# Altium project USB Hub Breakout V2.PrjPcb
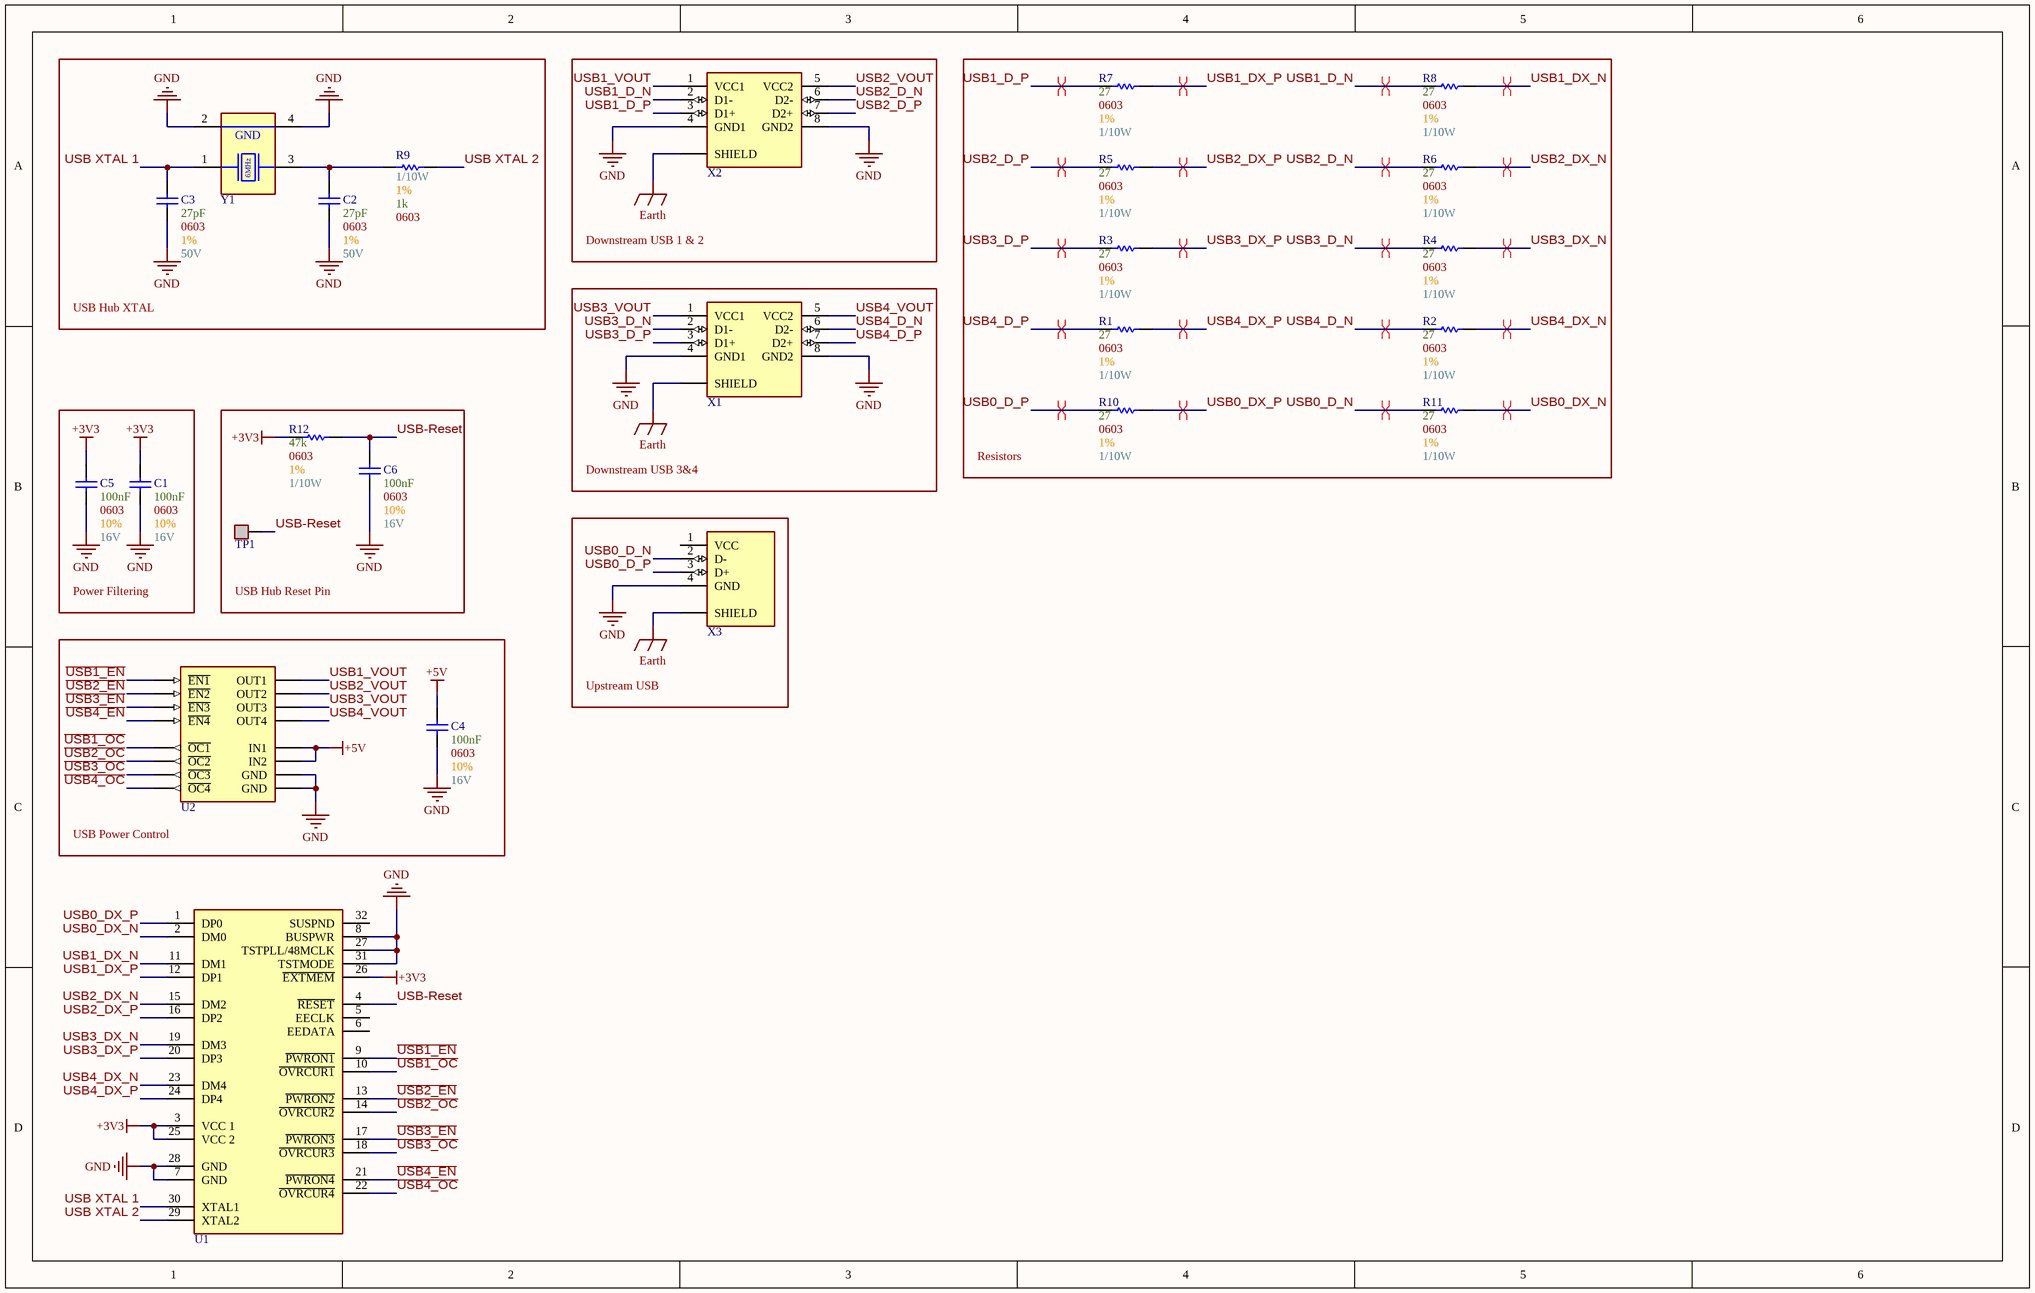
[diagram p0: USB Hub.SchDoc]
2 sheets, 38 parts. Net scope: global (net labels, ports and power ports of the same name join across sheets).
Board file: Main.PcbDoc
Sheets:
  USB Hub.SchDoc
  Regulator.SchDoc

## Sheet USB Hub.SchDoc
size B; SheetNumber: 1; SheetTotal: 2

### Parts
C1  Max Voltage: 16V  Size Package: 0603  Tolerance: 10%  Capacitance: 100nF  [[Cap] SMD 0603]  (hidden comment: [Cap] 0603 0.1uF 10% 16V)
C2  Max Voltage: 50V  Size Package: 0603  Tolerance: 1%  Capacitance: 27pF  [[Cap] SMD 0603]  (hidden comment: [Cap] 0603 27pF 1% 50V)
C3  Max Voltage: 50V  Size Package: 0603  Tolerance: 1%  Capacitance: 27pF  [[Cap] SMD 0603]  (hidden comment: [Cap] 0603 27pF 1% 50V)
C4  Max Voltage: 16V  Size Package: 0603  Tolerance: 10%  Capacitance: 100nF  [[Cap] SMD 0603]  (hidden comment: [Cap] 0603 0.1uF 10% 16V)
C5  Max Voltage: 16V  Size Package: 0603  Tolerance: 10%  Capacitance: 100nF  [[Cap] SMD 0603]  (hidden comment: [Cap] 0603 0.1uF 10% 16V)
C6  Max Voltage: 16V  Size Package: 0603  Tolerance: 10%  Capacitance: 100nF  [[Cap] SMD 0603]  (hidden comment: [Cap] 0603 0.1uF 10% 16V)
R1  Wattage: 1/10W  Tolerance: 1%  Resistance: 27  Size Package: 0603  [[Res] SMD 0603]  (hidden comment: [27] SMD 0603 1% 1/10W)
R2  Wattage: 1/10W  Tolerance: 1%  Resistance: 27  Size Package: 0603  [[Res] SMD 0603]  (hidden comment: [27] SMD 0603 1% 1/10W)
R3  Wattage: 1/10W  Tolerance: 1%  Resistance: 27  Size Package: 0603  [[Res] SMD 0603]  (hidden comment: [27] SMD 0603 1% 1/10W)
R4  Wattage: 1/10W  Tolerance: 1%  Resistance: 27  Size Package: 0603  [[Res] SMD 0603]  (hidden comment: [27] SMD 0603 1% 1/10W)
R5  Wattage: 1/10W  Tolerance: 1%  Resistance: 27  Size Package: 0603  [[Res] SMD 0603]  (hidden comment: [27] SMD 0603 1% 1/10W)
R6  Wattage: 1/10W  Tolerance: 1%  Resistance: 27  Size Package: 0603  [[Res] SMD 0603]  (hidden comment: [27] SMD 0603 1% 1/10W)
R7  Wattage: 1/10W  Tolerance: 1%  Resistance: 27  Size Package: 0603  [[Res] SMD 0603]  (hidden comment: [27] SMD 0603 1% 1/10W)
R8  Wattage: 1/10W  Tolerance: 1%  Resistance: 27  Size Package: 0603  [[Res] SMD 0603]  (hidden comment: [27] SMD 0603 1% 1/10W)
R9  Wattage: 1/10W  Tolerance: 1%  Resistance: 1k  Size Package: 0603  [[Res] SMD 0603]  (hidden comment: [1k] SMD 0603 1% 1/10W)
R10  Wattage: 1/10W  Tolerance: 1%  Resistance: 27  Size Package: 0603  [[Res] SMD 0603]  (hidden comment: [27] SMD 0603 1% 1/10W)
R11  Wattage: 1/10W  Tolerance: 1%  Resistance: 27  Size Package: 0603  [[Res] SMD 0603]  (hidden comment: [27] SMD 0603 1% 1/10W)
R12  Wattage: 1/10W  Tolerance: 1%  Resistance: 47k  Size Package: 0603  [[Res] SMD 0603]  (hidden comment: [47k] SMD 0603 1% 1/10W)
TP1  [THM] Thru-Hole  [[THM] White]  (value not drawn)
U1  4port  [[USB Hub] USB2.0 4port]  (value not drawn)
U2  [USB Power] 500mA 4port  [[IC] USB Hub Power Distribution]  (value not drawn)
X1  USB-A  [[USB] Type-A Dual]  (value not drawn)
X2  USB-A  [[USB] Type-A Dual]  (value not drawn)
X3  USB-A  [[USB] Type-A]  (value not drawn)
Y1  [Crystal] SMD 6MHz  [[Crystal] SMD 6MHz]  (value not drawn)

### Blocks framed on the sheet
USB Hub XTAL: C2 C3 R9 Y1
Downstream USB 1 & 2: X2
Resistors: R1-R8 R10 R11
Downstream USB 3&4: X1
Power Filtering: C1 C5
USB Hub Reset Pin: C6 R12 TP1
Upstream USB: X3
USB Power Control: C4 U2

### Nets
+3V3: C1.2 C5.2 R12.1 U1.3(VCC_1) U1.25(VCC_2) U1.26(~{EXTMEM})
+5V: C4.2 U2.2(IN1) U2.6(IN2)
Earth: X1.MH(SHIELD) X2.MH(SHIELD) X3.MH(SHIELD)
GND: C1.1 C2.1 C3.1 C4.1 C5.1 C6.1 U1.7(GND) U1.8(BUSPWR) U1.27(TSTPLL/48MCLK) U1.28(GND) U1.31(TSTMODE) U2.1(GND) U2.5(GND) X1.4(GND1) X1.8(GND2) X2.4(GND1) X2.8(GND2) X3.4(GND) Y1.2(GND) Y1.4(GND)
~{USB1_EN}: U1.9(~{PWRON1}) U2.3(~{EN1})
~{USB1_OC}: U1.10(~{OVRCUR1}) U2.16(~{OC1})
~{USB2_EN}: U1.13(~{PWRON2}) U2.4(~{EN2})
~{USB2_OC}: U1.14(~{OVRCUR2}) U2.13(~{OC2})
~{USB3_EN}: U1.17(~{PWRON3}) U2.7(~{EN3})
~{USB3_OC}: U1.18(~{OVRCUR3}) U2.12(~{OC3})
~{USB4_EN}: U1.21(~{PWRON4}) U2.8(~{EN4})
~{USB4_OC}: U1.22(~{OVRCUR4}) U2.9(~{OC4})
USB0_D_N: R11.1 X3.2(D-)
USB0_D_P: R10.1 X3.3(D+)
USB0_DX_N: R11.2 U1.2(DM0)
USB0_DX_P: R10.2 U1.1(DP0)
USB1_D_N: R8.1 X2.2(D1-)
USB1_D_P: R7.1 X2.3(D1+)
USB1_DX_N: R8.2 U1.11(DM1)
USB1_DX_P: R7.2 U1.12(DP1)
USB1_VOUT: U2.15(OUT1) X2.1(VCC1)
USB2_D_N: R6.1 X2.6(D2-)
USB2_D_P: R5.1 X2.7(D2+)
USB2_DX_N: R6.2 U1.15(DM2)
USB2_DX_P: R5.2 U1.16(DP2)
USB2_VOUT: U2.14(OUT2) X2.5(VCC2)
USB3_D_N: R4.1 X1.2(D1-)
USB3_D_P: R3.1 X1.3(D1+)
USB3_DX_N: R4.2 U1.19(DM3)
USB3_DX_P: R3.2 U1.20(DP3)
USB3_VOUT: U2.11(OUT3) X1.1(VCC1)
USB4_D_N: R2.1 X1.6(D2-)
USB4_D_P: R1.1 X1.7(D2+)
USB4_DX_N: R2.2 U1.23(DM4)
USB4_DX_P: R1.2 U1.24(DP4)
USB4_VOUT: U2.10(OUT4) X1.5(VCC2)
USB XTAL 1: C3.2 U1.30(XTAL1) Y1.1(XTAL1)
USB XTAL 2: R9.2 U1.29(XTAL2)
USB-Reset: C6.2 R12.2 TP1.1 U1.4(~{RESET})
NetC2_2: C2.2 R9.1 Y1.3(XTAL2)

Not connected (* = marked no-connect by the designer): U1 5(EECLK) 6(EEDATA) 32(SUSPND); X3 1(VCC)

### Layout directives
differential pair; differential pair class USB_Pairs: USB0_D_N, USB0_D_P, USB0_DX_N, USB0_DX_P, USB1_D_N, USB1_D_P, USB1_DX_N, USB1_DX_P, USB2_D_N, USB2_D_P, USB2_DX_N, USB2_DX_P, USB3_D_N, USB3_D_P, USB3_DX_N, USB3_DX_P, USB4_D_N, USB4_D_P, USB4_DX_N, USB4_DX_P

### Notes on the sheet
- (in symbol [Crystal] SMD 6MHz) 6MHz

### Library data of the parts
C1 C4-C6 = [Cap] 0603 0.1uF 10% 16V: CC0603KRX7R7BB104; Supplier 1: DigiKey; Supplier Part Number 1: 311-1088-6-ND
C2 C3 = [Cap] 0603 27pF 1% 50V: 0603N270F500CT; Supplier 1: DigiKey; Supplier Part Number 1: 1292-1510-1-ND
R1-R8 R10 R11 = [27] SMD 0603 1% 1/10W: MCT06030C2709FP500; Supplier 1: DigiKey; Supplier Part Number 1: 749-1631-1-ND
R9 = [1k] SMD 0603 1% 1/10W: RMCF0603FT1K00; Supplier 1: DigiKey; Supplier Part Number 1: RMCF0603FT1K00DKR-ND
R12 = [47k] SMD 0603 1% 1/10W: RC0603FR-0747KL; Supplier 1: DigiKey; Supplier Part Number 1: 311-47.0KHRDKR-ND
TP1 = [THM] Thru-Hole: 5012; Supplier 1: DigiKey; Supplier Part Number 1: 36-5012-ND
U1 = [USB Hub] USB 2.0 4port: TUSB2046BVFR; Supplier 1: DigiKey; Supplier Part Number 1: 296-27131-1-ND
U2 = [USB Power] 500mA 4port: TPS2044BDR; Supplier 1: DigiKey; Supplier Part Number 1: 296-26909-6-ND
X1 X2 = [USB] Type-A Dual: 61400826021; Supplier 1: DigiKey; Supplier Part Number 1: 732-2107-ND
X3 = [USB] Type-A: KUSBEX-ASFS1N-B; Supplier 1: DigiKey; Supplier Part Number 1: 2092-KUSBEX-ASFS1N-B-ND
Y1 = [Crystal] SMD 6MHz: ECS-060-18-20BM-JEN-TR; Supplier 1: DigiKey; Supplier Part Number 1: XC2349DKR-ND

## Sheet Regulator.SchDoc
size A; SheetNumber: 2; SheetTotal: 2
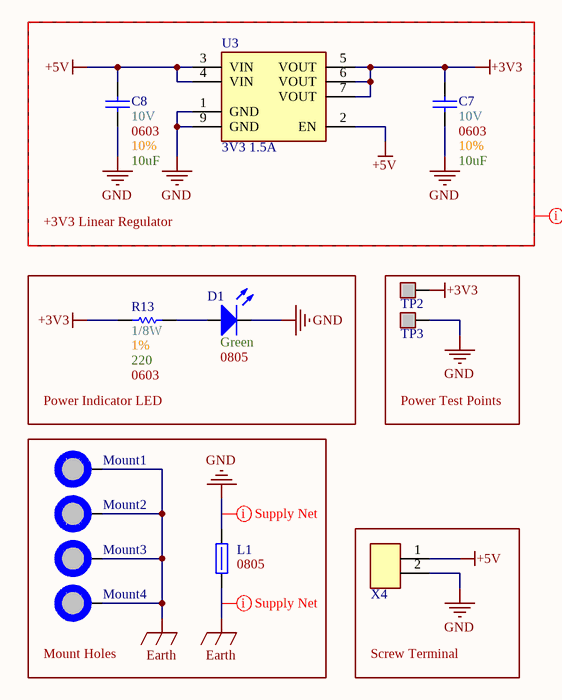
[diagram p1: Regulator.SchDoc]

### Parts
C7  Max Voltage: 10V  Size Package: 0603  Tolerance: 10%  Capacitance: 10uF  [[Cap] SMD 0603]  (hidden comment: [Cap] 0603 10uF 10% 10V)
C8  Max Voltage: 10V  Size Package: 0603  Tolerance: 10%  Capacitance: 10uF  [[Cap] SMD 0603]  (hidden comment: [Cap] 0603 10uF 10% 10V)
D1  Color: Green  Size Package: 0805  [[LED] SMD 0805]  (hidden comment: [LED] SMD 0805 Green)
L1  Size Package: 0805  [[Ferrite] SMD 0805]  (hidden comment: 652-MH2029-300Y)
Mount1  M3 Mount Hole  [[Mount] M3 Mount Hole]  (value not drawn)  (no BOM)
Mount2  M3 Mount Hole  [[Mount] M3 Mount Hole]  (value not drawn)  (no BOM)
Mount3  M3 Mount Hole  [[Mount] M3 Mount Hole]  (value not drawn)  (no BOM)
Mount4  M3 Mount Hole  [[Mount] M3 Mount Hole]  (value not drawn)  (no BOM)
R13  Wattage: 1/8W  Tolerance: 1%  Resistance: 220  Size Package: 0603  [[Res] SMD 0603]  (hidden comment: [220] SMD 0603 1% 1/10W)
TP2  [THM] Thru-Hole  [[THM] White]  (value not drawn)
TP3  [THM] Thru-Hole  [[THM] White]  (value not drawn)
U3  3V3 1.5A  [[Linear] 3V3 1.5A]
X4  2pin Screw Terminal  [[Screw Terminal] 2pin 5mm]  (value not drawn)

### Blocks framed on the sheet
+3V3 Linear Regulator: C7 C8 U3
Power Indicator LED: D1 R13
Power Test Points: TP2 TP3
Mount Holes: L1 Mount1-Mount4
Screw Terminal: X4

### Nets
+3V3: C7.2 R13.1 TP2.1 U3.5(VOUT) U3.6(VOUT) U3.7(VOUT)
+5V: C8.2 U3.2(EN) U3.3(VIN) U3.4(VIN) X4.1
Earth: L1.1 Mount1.1 Mount2.1 Mount3.1 Mount4.1
GND: C7.1 C8.1 D1.2(Cathode) L1.2 TP3.1 U3.1(GND) U3.9(GND) X4.2
NetD1_1: D1.1(Anode) R13.2

### Layout directives
net class Supply_Nets: +3V3, +5V, Earth, GND

### Library data of the parts
C7 C8 = [Cap] 0603 10uF 10% 10V: CL10A106KP8NNNC; Supplier 1: DigiKey; Supplier Part Number 1: 1276-1192-6-ND
D1 = [LED] SMD 0805 Green: LG R971-KN-1-0-20-R18; Supplier 1: DigiKey; Supplier Part Number 1: 475-LGR971-KN-1CT-ND
L1 = [Ferrite] SMD 0805 3A 30ohm: Res @ Freq: 30 @ 100MHz; Supplier 1: DigiKey; Supplier Part Number 1: MH2029-300YCT-ND
Mount1-Mount4 = [Mount] M3 Mount Hole: Place at least 4.5mm from board edge. Plated.
R13 = [220] SMD 0603 1% 1/10W: CRGCQ0805F220R; Supplier 1: DigiKey; Supplier Part Number 1: A129741CT-ND
TP2 TP3 = [THM] Thru-Hole: 5012; Supplier 1: DigiKey; Supplier Part Number 1: 36-5012-ND
U3 = [Linear] 3V3 1.5A: AP7362A-33SP-13; Supplier 1: DigiKey; Supplier Part Number 1: AP7362A-33SP-13DICT-ND
X4 = [Screw Terminal] 2pin: TB002-500-02BE; Supplier 1: DigiKey; Supplier Part Number 1: 102-6145-ND

## Nets that join several sheets
+3V3: USB Hub (6 pins), Regulator (6 pins)
+5V: USB Hub (C4.2 U2.2 U2.6), Regulator (5 pins)
Earth: USB Hub (X1.MH X2.MH X3.MH), Regulator (5 pins)
GND: USB Hub (20 pins), Regulator (8 pins)